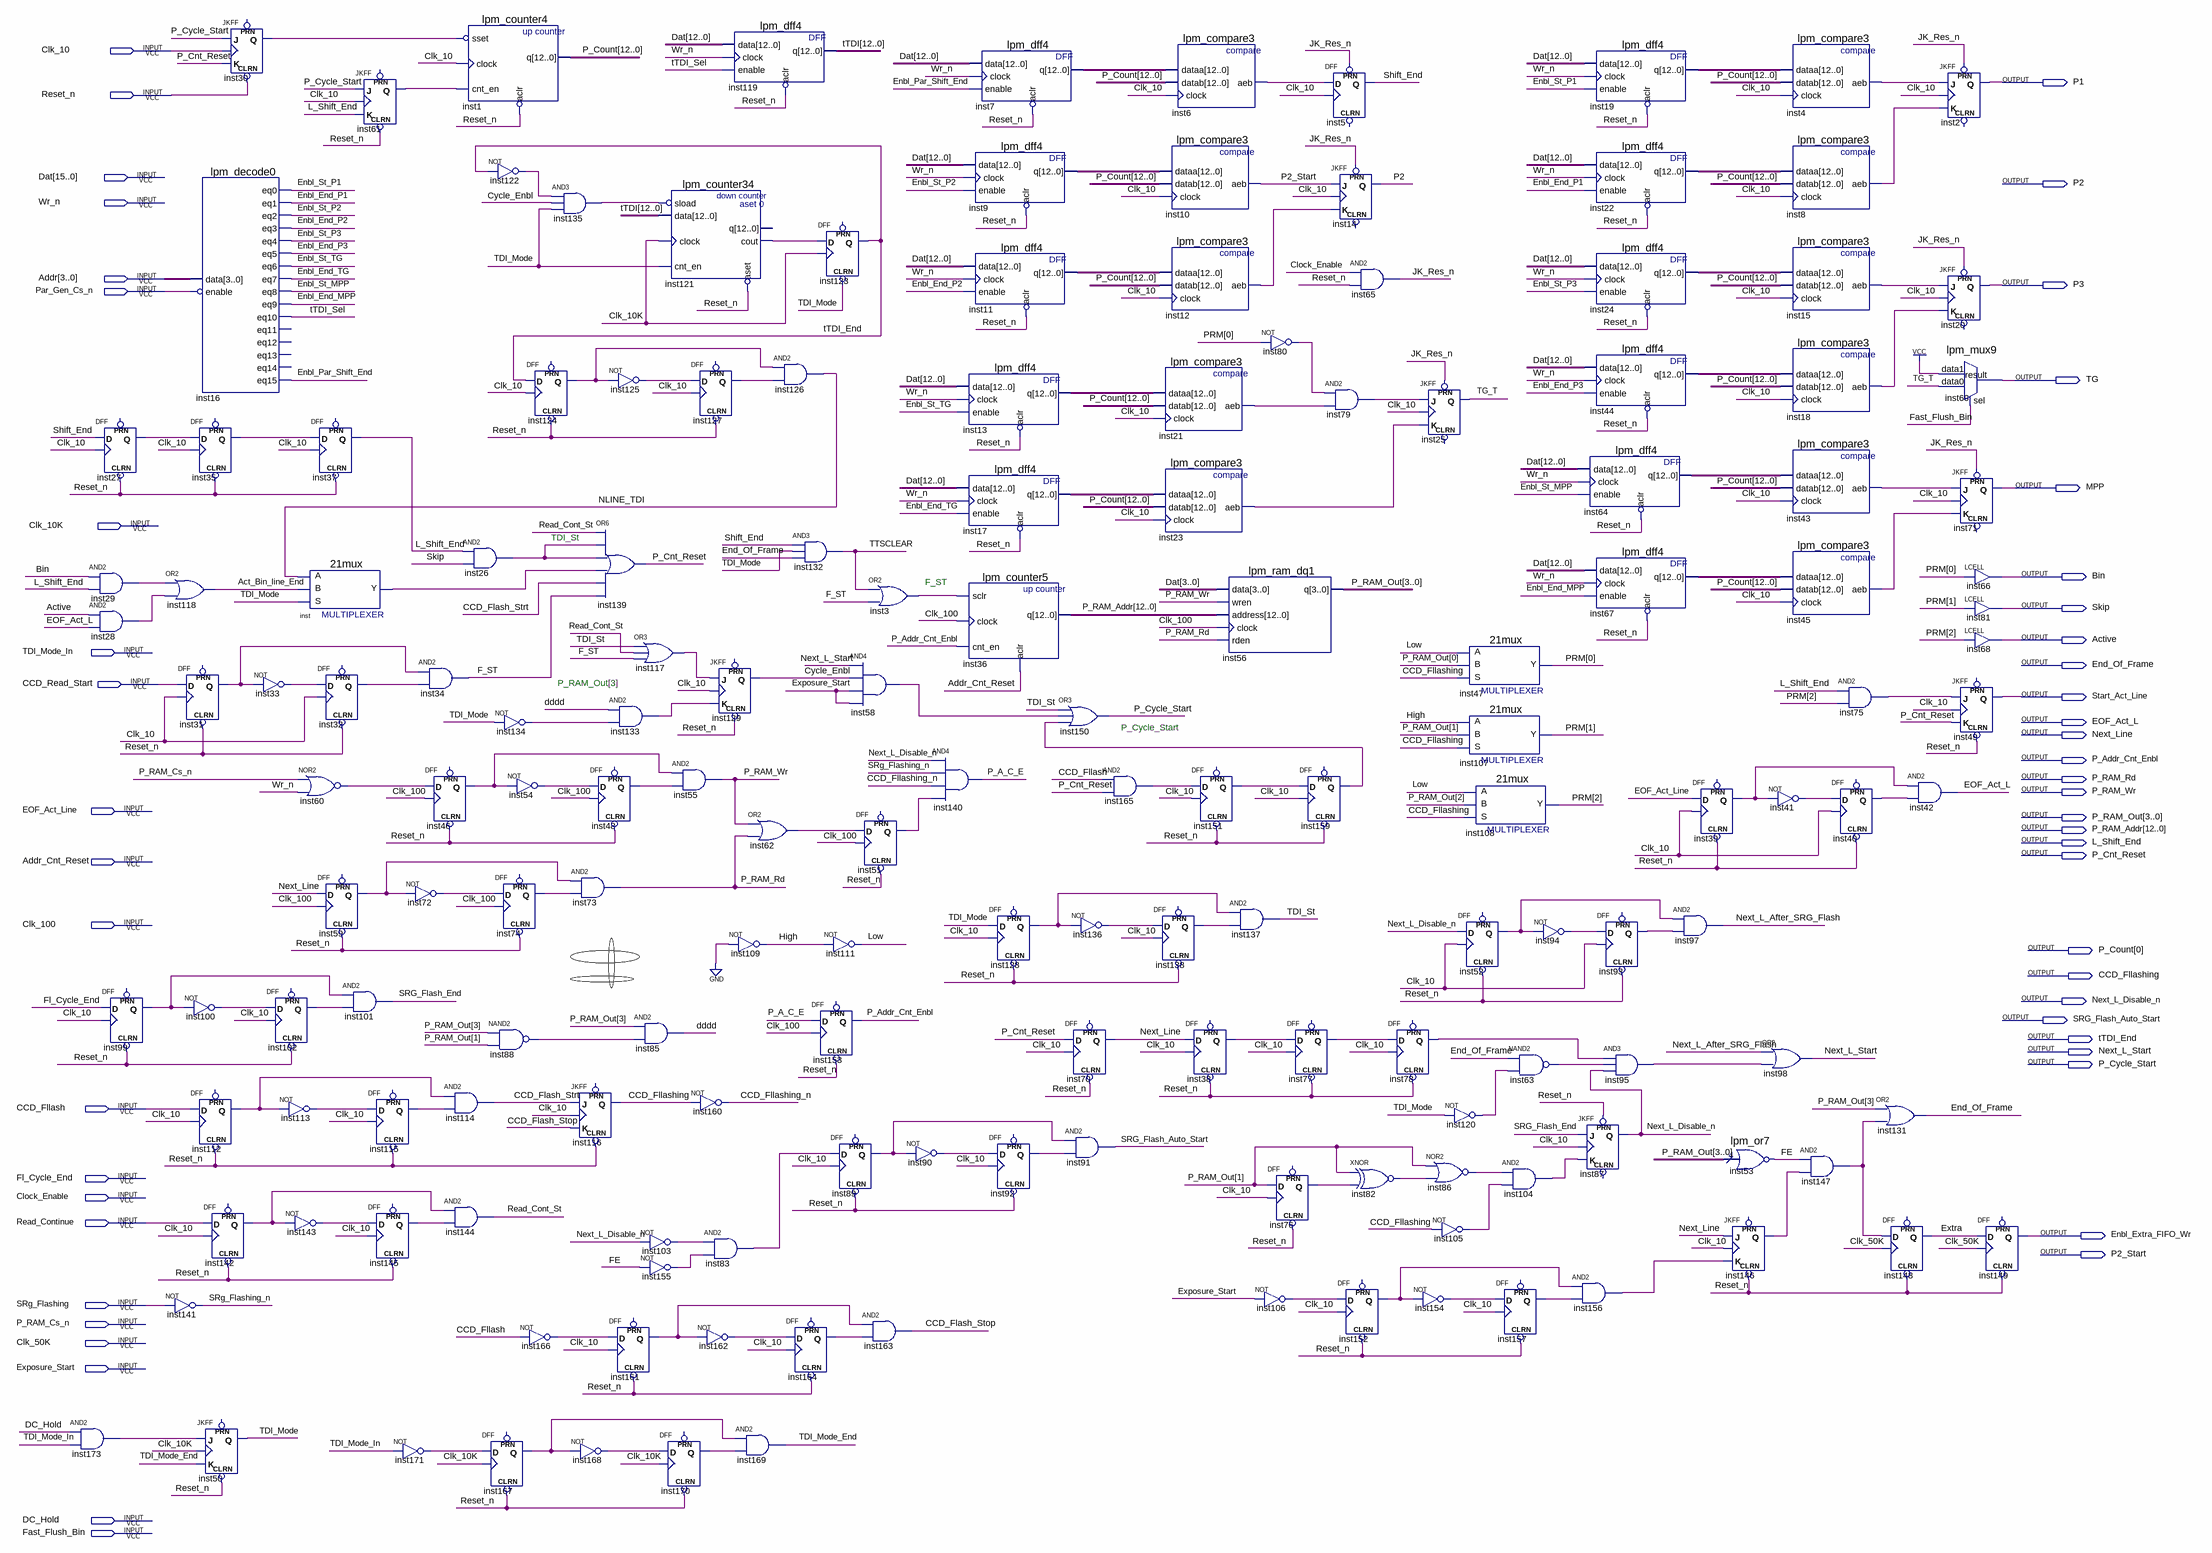
[diagram p0: schematic sheet]
// Quartus schematic Parallel_Clocks_Generator.bdf as structural Verilog: 167 symbols, 50 pins
module Parallel_Clocks_Generator (
  input  Clk_10,
  input  Reset_n,
  input  [15:0] Dat,
  input  Wr_n,
  input  [3:0] Addr,
  input  Par_Gen_Cs_n,
  input  Clk_10K,
  input  TDI_Mode_In,
  input  CCD_Read_Start,
  input  EOF_Act_Line,
  input  Addr_Cnt_Reset,
  input  Clk_100,
  input  CCD_Fllash,
  input  Fl_Cycle_End,
  input  Clock_Enable,
  input  Read_Continue,
  input  SRg_Flashing,
  input  P_RAM_Cs_n,
  input  Clk_50K,
  input  Exposure_Start,
  input  DC_Hold,
  input  Fast_Flush_Bin,
  output P1,
  output P2,
  output P3,
  output TG,
  output MPP,
  output Bin,
  output Skip,
  output Active,
  output End_Of_Frame,
  output Start_Act_Line,
  output EOF_Act_L,
  output Next_Line,
  output P_Addr_Cnt_Enbl,
  output P_RAM_Rd,
  output P_RAM_Wr,
  output [3:0] P_RAM_Out,
  output [12:0] P_RAM_Addr,
  output L_Shift_End,
  output P_Cnt_Reset,
  output [12:0] P_Count,
  output CCD_Fllashing,
  output Next_L_Disable_n,
  output SRG_Flash_Auto_Start,
  output tTDI_End,
  output Next_L_Start,
  output P_Cycle_Start,
  output Enbl_Extra_FIFO_Wr,
  output P2_Start
);

  wire Act_Bin_line_End, CCD_Flash_Stop, CCD_Flash_Strt, CCD_Fllashing_n, Cycle_Enbl, dddd, Enbl_End_MPP,
       Enbl_End_P1, Enbl_End_P2, Enbl_End_P3, Enbl_End_TG, Enbl_Par_Shift_End, Enbl_St_MPP, Enbl_St_P1,
       Enbl_St_P2, Enbl_St_P3, Enbl_St_TG, Extra, F_ST, FE, High, inst3_out, inst4_aeb, inst6_aeb, inst8_aeb,
       inst12_aeb, inst15_aeb, inst18_aeb, inst21_aeb, inst23_aeb, inst26_out, inst27_q, inst28_out,
       inst29_out, inst30_q, inst31_q, inst32_q, inst33_out, inst35_q, inst38_q, inst39_q, inst40_q,
       inst41_out, inst43_aeb, inst45_aeb, inst46_q, inst48_q, inst51_q, inst52_q, inst53_result, inst54_out,
       inst58_out, inst59_q, inst60_out, inst61_q, inst62_out, inst63_out, inst72_out, inst74_q, inst75_out,
       inst76_q, inst77_q, inst78_q, inst79_out, inst80_out, inst82_out, inst83_out, inst86_out, inst88_out,
       inst89_q, inst90_out, inst92_q, inst93_q, inst94_out, inst95_out, inst99_q, inst100_out, inst102_q,
       inst103_out, inst104_out, inst105_out, inst106_out, inst112_q, inst113_out, inst115_q, inst117_out,
       inst120_out, inst121_cout, inst122_out, inst124_q, inst125_out, inst127_q, inst128_q, inst133_out,
       inst134_out, inst135_out, inst136_out, inst138_q, inst142_q, inst143_out, inst145_q, inst146_q,
       inst147_out, inst151_q, inst152_q, inst154_out, inst155_out, inst156_out, inst157_q, inst159_q,
       inst161_q, inst162_out, inst164_q, inst165_out, inst166_out, inst167_q, inst168_out, inst170_q,
       inst171_out, inst173_out, inst_y, JK_Res_n, Low, Next_L_After_SRG_Flash, NLINE_TDI, P_A_C_E,
       Read_Cont_St, Shift_End, SRG_Flash_End, SRg_Flashing_n, TDI_Mode, TDI_Mode_End, TDI_St, TG_T,
       tTDI_Sel, TTSCLEAR;
  wire [2:0] PRM;
  wire [12:0] inst7_q, inst9_q, inst11_q, inst13_q, inst17_q, inst19_q, inst22_q, inst24_q, inst44_q,
       inst64_q, inst67_q, tTDI;

  and inst173 (inst173_out, DC_Hold, TDI_Mode_In);
  DFF inst27 (.CLRN(Reset_n), .CLK(Clk_10), .D(Shift_End), .Q(inst27_q));  // open: PRN
  and inst29 (inst29_out, Bin, L_Shift_End);
  and inst28 (inst28_out, Active, EOF_Act_L);
  DFF inst99 (.CLRN(Reset_n), .CLK(Clk_10), .D(Fl_Cycle_End), .Q(inst99_q));  // open: PRN
  or inst118 (Act_Bin_line_End, inst29_out, inst28_out);
  not inst141 (SRg_Flashing_n, SRg_Flashing);
  JKFF inst30 (.CLRN(Reset_n), .K(P_Cnt_Reset), .J(P_Cycle_Start), .CLK(Clk_10), .Q(inst30_q));  // open: PRN
  lpm_decode0 inst16 (
    .data(Addr), .enable(~Par_Gen_Cs_n), .eq0(Enbl_St_P1), .eq1(Enbl_End_P1), .eq2(Enbl_St_P2),
    .eq3(Enbl_End_P2), .eq4(Enbl_St_P3), .eq5(Enbl_End_P3), .eq6(Enbl_St_TG), .eq7(Enbl_End_TG),
    .eq8(Enbl_St_MPP), .eq9(Enbl_End_MPP), .eq10(tTDI_Sel), .eq15(Enbl_Par_Shift_End));  // open: eq11, eq12, eq13, eq14
  DFF inst35 (.CLRN(Reset_n), .CLK(Clk_10), .D(inst27_q), .Q(inst35_q));  // open: PRN
  DFF inst31 (.CLRN(Reset_n), .CLK(Clk_10), .D(CCD_Read_Start), .Q(inst31_q));  // open: PRN
  not inst100 (inst100_out, inst99_q);
  DFF inst112 (.CLRN(Reset_n), .CLK(Clk_10), .D(CCD_Fllash), .Q(inst112_q));  // open: PRN
  DFF inst142 (.CLRN(Reset_n), .CLK(Clk_10), .D(Read_Continue), .Q(inst142_q));  // open: PRN
  JKFF inst50 (.CLRN(Reset_n), .K(TDI_Mode_End), .J(inst173_out), .CLK(Clk_10K), .Q(TDI_Mode));  // open: PRN
  not inst33 (inst33_out, inst31_q);
  DFF inst102 (.CLRN(Reset_n), .CLK(Clk_10), .D(inst100_out), .Q(inst102_q));  // open: PRN
  DFF inst37 (.CLRN(Reset_n), .CLK(Clk_10), .D(inst35_q), .Q(L_Shift_End));  // open: PRN
  \21mux  inst (.S(TDI_Mode), .B(Act_Bin_line_End), .A(NLINE_TDI), .Y(inst_y));
  DFF inst32 (.CLRN(Reset_n), .CLK(Clk_10), .D(inst33_out), .Q(inst32_q));  // open: PRN
  nor inst60 (inst60_out, P_RAM_Cs_n, Wr_n);
  DFF inst59 (.CLRN(Reset_n), .CLK(Clk_100), .D(Next_Line), .Q(inst59_q));  // open: PRN
  not inst113 (inst113_out, inst112_q);
  not inst143 (inst143_out, inst142_q);
  JKFF inst61 (.CLRN(Reset_n), .K(L_Shift_End), .J(P_Cycle_Start), .CLK(Clk_10), .Q(inst61_q));  // open: PRN
  and inst101 (SRG_Flash_End, inst99_q, inst102_q);
  DFF inst115 (.CLRN(Reset_n), .CLK(Clk_10), .D(inst113_out), .Q(inst115_q));  // open: PRN
  DFF inst145 (.CLRN(Reset_n), .CLK(Clk_10), .D(inst143_out), .Q(inst145_q));  // open: PRN
  and inst34 (F_ST, inst31_q, inst32_q);
  DFF inst46 (.CLRN(Reset_n), .CLK(Clk_100), .D(inst60_out), .Q(inst46_q));  // open: PRN
  not inst72 (inst72_out, inst59_q);
  not inst171 (inst171_out, TDI_Mode_In);
  lpm_counter4 inst1 (.sset(~inst30_q), .clock(Clk_10), .cnt_en(inst61_q), .aclr(~Reset_n), .q(P_Count));
  and inst26 (inst26_out, L_Shift_End, Skip);
  and inst114 (CCD_Flash_Strt, inst112_q, inst115_q);
  and inst144 (Read_Cont_St, inst142_q, inst145_q);
  not inst122 (inst122_out, tTDI_End);
  DFF inst124 (.CLRN(Reset_n), .CLK(Clk_10), .D(tTDI_End), .Q(inst124_q));  // open: PRN
  not inst134 (inst134_out, TDI_Mode);
  not inst54 (inst54_out, inst46_q);
  DFF inst74 (.CLRN(Reset_n), .CLK(Clk_100), .D(inst72_out), .Q(inst74_q));  // open: PRN
  nand inst88 (inst88_out, P_RAM_Out[3], P_RAM_Out[1]);
  not inst166 (inst166_out, CCD_Fllash);
  DFF inst167 (.CLRN(Reset_n), .CLK(Clk_10K), .D(inst171_out), .Q(inst167_q));  // open: PRN
  and inst135 (inst135_out, inst122_out, Cycle_Enbl, TDI_Mode);
  and inst73 (P_RAM_Rd, inst59_q, inst74_q);
  JKFF inst116 (.CLRN(Reset_n), .K(CCD_Flash_Stop), .J(CCD_Flash_Strt), .CLK(Clk_10), .Q(CCD_Fllashing));  // open: PRN
  not inst168 (inst168_out, inst167_q);
  not inst125 (inst125_out, inst124_q);
  or inst139 (P_Cnt_Reset, Read_Cont_St, inst26_out, inst26_out, inst_y, CCD_Flash_Strt, F_ST);
  and inst133 (inst133_out, dddd, inst134_out);
  DFF inst48 (.CLRN(Reset_n), .CLK(Clk_100), .D(inst54_out), .Q(inst48_q));  // open: PRN
  DFF inst161 (.CLRN(Reset_n), .CLK(Clk_10), .D(inst166_out), .Q(inst161_q));  // open: PRN
  lpm_counter34 inst121 (
    .sload(~inst135_out), .data(tTDI), .clock(Clk_10K), .cnt_en(TDI_Mode), .aset(~Reset_n),
    .cout(inst121_cout));  // open: q
  or inst117 (inst117_out, TDI_St, Read_Cont_St, F_ST);
  and inst55 (P_RAM_Wr, inst46_q, inst48_q);
  and inst85 (dddd, P_RAM_Out[3], inst88_out);
  not inst103 (inst103_out, Next_L_Disable_n);
  not inst155 (inst155_out, FE);
  DFF inst170 (.CLRN(Reset_n), .CLK(Clk_10K), .D(inst168_out), .Q(inst170_q));  // open: PRN
  lpm_dff4 inst119 (.data(Dat[12:0]), .clock(Wr_n), .enable(tTDI_Sel), .aclr(~Reset_n), .q(tTDI));
  DFF inst127 (.CLRN(Reset_n), .CLK(Clk_10), .D(inst125_out), .Q(inst127_q));  // open: PRN
  JKFF inst129 (.CLRN(Reset_n), .K(inst133_out), .J(inst117_out), .CLK(Clk_10), .Q(Cycle_Enbl));  // open: PRN
  not inst109 (High, 1'b0);
  not inst160 (CCD_Fllashing_n, CCD_Fllashing);
  and inst83 (inst83_out, inst103_out, inst155_out);
  not inst162 (inst162_out, inst161_q);
  and inst126 (NLINE_TDI, inst124_q, inst127_q);
  or inst62 (inst62_out, P_RAM_Wr, P_RAM_Rd);
  and inst169 (TDI_Mode_End, inst167_q, inst170_q);
  DFF inst123 (.CLRN(TDI_Mode), .CLK(Clk_10K), .D(inst121_cout), .Q(tTDI_End));  // open: PRN
  and inst132 (TTSCLEAR, Shift_End, TDI_Mode, End_Of_Frame);
  not inst111 (Low, High);
  DFF inst153 (.CLRN(Reset_n), .CLK(Clk_100), .D(P_A_C_E), .Q(P_Addr_Cnt_Enbl));  // open: PRN
  DFF inst89 (.CLRN(Reset_n), .CLK(Clk_10), .D(inst83_out), .Q(inst89_q));  // open: PRN
  DFF inst164 (.CLRN(Reset_n), .CLK(Clk_10), .D(inst162_out), .Q(inst164_q));  // open: PRN
  or inst3 (inst3_out, TTSCLEAR, F_ST);
  and inst58 (inst58_out, Next_L_Start, Cycle_Enbl, Exposure_Start, Exposure_Start);
  DFF inst51 (.CLRN(Reset_n), .CLK(Clk_100), .D(inst62_out), .Q(inst51_q));  // open: PRN
  and inst163 (CCD_Flash_Stop, inst161_q, inst164_q);
  and inst140 (P_A_C_E, Next_L_Disable_n, SRg_Flashing_n, CCD_Fllashing_n, inst51_q);
  not inst90 (inst90_out, inst89_q);
  lpm_dff4 inst7 (.data(Dat[12:0]), .clock(Wr_n), .enable(Enbl_Par_Shift_End), .aclr(~Reset_n), .q(inst7_q));
  lpm_dff4 inst9 (.data(Dat[12:0]), .clock(Wr_n), .enable(Enbl_St_P2), .aclr(~Reset_n), .q(inst9_q));
  lpm_dff4 inst11 (.data(Dat[12:0]), .clock(Wr_n), .enable(Enbl_End_P2), .aclr(~Reset_n), .q(inst11_q));
  lpm_dff4 inst13 (.data(Dat[12:0]), .clock(Wr_n), .enable(Enbl_St_TG), .aclr(~Reset_n), .q(inst13_q));
  lpm_dff4 inst17 (.data(Dat[12:0]), .clock(Wr_n), .enable(Enbl_End_TG), .aclr(~Reset_n), .q(inst17_q));
  lpm_counter5 inst36 (
    .sclr(inst3_out), .clock(Clk_100), .cnt_en(P_Addr_Cnt_Enbl), .aclr(Addr_Cnt_Reset), .q(P_RAM_Addr));
  DFF inst128 (.CLRN(Reset_n), .CLK(Clk_10), .D(TDI_Mode), .Q(inst128_q));  // open: PRN
  DFF inst92 (.CLRN(Reset_n), .CLK(Clk_10), .D(inst90_out), .Q(inst92_q));  // open: PRN
  or inst150 (P_Cycle_Start, TDI_St, inst58_out, inst159_q);
  not inst136 (inst136_out, inst128_q);
  DFF inst70 (.CLRN(Reset_n), .CLK(Clk_10), .D(P_Cnt_Reset), .Q(Next_Line));  // open: PRN
  and inst91 (SRG_Flash_Auto_Start, inst89_q, inst92_q);
  and inst165 (inst165_out, CCD_Fllash, P_Cnt_Reset);
  lpm_compare3 inst6 (.dataa(inst7_q), .datab(P_Count), .clock(Clk_10), .aeb(inst6_aeb));
  lpm_compare3 inst10 (.dataa(inst9_q), .datab(P_Count), .clock(Clk_10), .aeb(P2_Start));
  lpm_compare3 inst12 (.dataa(inst11_q), .datab(P_Count), .clock(Clk_10), .aeb(inst12_aeb));
  lpm_compare3 inst21 (.dataa(inst13_q), .datab(P_Count), .clock(Clk_10), .aeb(inst21_aeb));
  lpm_compare3 inst23 (.dataa(inst17_q), .datab(P_Count), .clock(Clk_10), .aeb(inst23_aeb));
  DFF inst138 (.CLRN(Reset_n), .CLK(Clk_10), .D(inst136_out), .Q(inst138_q));  // open: PRN
  DFF inst38 (.CLRN(Reset_n), .CLK(Clk_10), .D(Next_Line), .Q(inst38_q));  // open: PRN
  lpm_ram_dq1 inst56 (
    .data(Dat[3:0]), .wren(P_RAM_Wr), .address(P_RAM_Addr), .clock(Clk_100), .rden(P_RAM_Rd), .q(P_RAM_Out));
  DFF inst151 (.CLRN(Reset_n), .CLK(Clk_10), .D(inst165_out), .Q(inst151_q));  // open: PRN
  and inst137 (TDI_St, inst128_q, inst138_q);
  not inst80 (inst80_out, PRM[0]);
  DFF inst77 (.CLRN(Reset_n), .CLK(Clk_10), .D(inst38_q), .Q(inst77_q));  // open: PRN
  DFF inst76 (.CLRN(Reset_n), .CLK(Clk_10), .D(P_RAM_Out[1]), .Q(inst76_q));  // open: PRN
  not inst106 (inst106_out, Exposure_Start);
  DFF inst5 (.CLK(Clk_10), .D(inst6_aeb), .PRN(JK_Res_n), .Q(Shift_End));  // open: CLRN
  JKFF inst14 (.PRN(JK_Res_n), .K(inst12_aeb), .J(P2_Start), .CLK(Clk_10), .Q(P2));  // open: CLRN
  and inst79 (inst79_out, inst80_out, inst21_aeb);
  DFF inst159 (.CLRN(Reset_n), .CLK(Clk_10), .D(inst151_q), .Q(inst159_q));  // open: PRN
  DFF inst152 (.CLRN(Reset_n), .CLK(Clk_10), .D(inst106_out), .Q(inst152_q));  // open: PRN
  and inst65 (JK_Res_n, Clock_Enable, Reset_n);
  DFF inst78 (.CLRN(Reset_n), .CLK(Clk_10), .D(inst77_q), .Q(inst78_q));  // open: PRN
  xnor inst82 (inst82_out, P_RAM_Out[1], inst76_q);
  JKFF inst25 (.PRN(JK_Res_n), .K(inst23_aeb), .J(inst79_out), .CLK(Clk_10), .Q(TG_T));  // open: CLRN
  nor inst86 (inst86_out, P_RAM_Out[1], inst82_out);
  not inst105 (inst105_out, CCD_Fllashing);
  not inst154 (inst154_out, inst152_q);
  \21mux  inst47 (.S(CCD_Fllashing), .B(P_RAM_Out[0]), .A(Low), .Y(PRM[0]));
  \21mux  inst107 (.S(CCD_Fllashing), .B(P_RAM_Out[1]), .A(High), .Y(PRM[1]));
  \21mux  inst108 (.S(CCD_Fllashing), .B(P_RAM_Out[2]), .A(Low), .Y(PRM[2]));
  DFF inst52 (.CLRN(Reset_n), .CLK(Clk_10), .D(Next_L_Disable_n), .Q(inst52_q));  // open: PRN
  not inst120 (inst120_out, TDI_Mode);
  not inst94 (inst94_out, inst52_q);
  nand inst63 (inst63_out, End_Of_Frame, inst120_out);
  and inst104 (inst104_out, inst86_out, inst105_out);
  DFF inst157 (.CLRN(Reset_n), .CLK(Clk_10), .D(inst154_out), .Q(inst157_q));  // open: PRN
  lpm_dff4 inst19 (.data(Dat[12:0]), .clock(Wr_n), .enable(Enbl_St_P1), .aclr(~Reset_n), .q(inst19_q));
  lpm_dff4 inst22 (.data(Dat[12:0]), .clock(Wr_n), .enable(Enbl_End_P1), .aclr(~Reset_n), .q(inst22_q));
  lpm_dff4 inst24 (.data(Dat[12:0]), .clock(Wr_n), .enable(Enbl_St_P3), .aclr(~Reset_n), .q(inst24_q));
  lpm_dff4 inst44 (.data(Dat[12:0]), .clock(Wr_n), .enable(Enbl_End_P3), .aclr(~Reset_n), .q(inst44_q));
  lpm_dff4 inst64 (.data(Dat[12:0]), .clock(Wr_n), .enable(Enbl_St_MPP), .aclr(~Reset_n), .q(inst64_q));
  lpm_dff4 inst67 (.data(Dat[12:0]), .clock(Wr_n), .enable(Enbl_End_MPP), .aclr(~Reset_n), .q(inst67_q));
  JKFF inst87 (.PRN(Reset_n), .K(inst104_out), .J(SRG_Flash_End), .CLK(Clk_10), .Q(Next_L_Disable_n));  // open: CLRN
  and inst156 (inst156_out, inst152_q, inst157_q);
  DFF inst93 (.CLRN(Reset_n), .CLK(Clk_10), .D(inst94_out), .Q(inst93_q));  // open: PRN
  and inst95 (inst95_out, inst78_q, inst63_out, Next_L_Disable_n);
  DFF inst39 (.CLRN(Reset_n), .CLK(Clk_10), .D(EOF_Act_Line), .Q(inst39_q));  // open: PRN
  and inst97 (Next_L_After_SRG_Flash, inst52_q, inst93_q);
  lpm_or7 inst53 (.data(P_RAM_Out), .result(inst53_result));
  not inst53_result_inverted (FE, inst53_result);
  JKFF inst146 (.CLRN(Reset_n), .K(inst156_out), .J(Next_Line), .CLK(Clk_10), .Q(inst146_q));  // open: PRN
  lpm_compare3 inst4 (.dataa(inst19_q), .datab(P_Count), .clock(Clk_10), .aeb(inst4_aeb));
  lpm_compare3 inst8 (.dataa(inst22_q), .datab(P_Count), .clock(Clk_10), .aeb(inst8_aeb));
  lpm_compare3 inst15 (.dataa(inst24_q), .datab(P_Count), .clock(Clk_10), .aeb(inst15_aeb));
  lpm_compare3 inst18 (.dataa(inst44_q), .datab(P_Count), .clock(Clk_10), .aeb(inst18_aeb));
  lpm_compare3 inst43 (.dataa(inst64_q), .datab(P_Count), .clock(Clk_10), .aeb(inst43_aeb));
  lpm_compare3 inst45 (.dataa(inst67_q), .datab(P_Count), .clock(Clk_10), .aeb(inst45_aeb));
  not inst41 (inst41_out, inst39_q);
  or inst98 (Next_L_Start, Next_L_After_SRG_Flash, inst95_out);
  and inst75 (inst75_out, L_Shift_End, PRM[2]);
  DFF inst40 (.CLRN(Reset_n), .CLK(Clk_10), .D(inst41_out), .Q(inst40_q));  // open: PRN
  and inst147 (inst147_out, FE, inst146_q);
  or inst131 (End_Of_Frame, P_RAM_Out[3], inst147_out);
  DFF inst148 (.CLRN(Reset_n), .CLK(Clk_50K), .D(inst147_out), .Q(Extra));  // open: PRN
  JKFF inst2 (.PRN(JK_Res_n), .K(inst8_aeb), .J(inst4_aeb), .CLK(Clk_10), .Q(P1));  // open: CLRN
  JKFF inst20 (.PRN(JK_Res_n), .K(inst18_aeb), .J(inst15_aeb), .CLK(Clk_10), .Q(P3));  // open: CLRN
  lpm_mux9 inst69 (.data1(1'b1), .data0(TG_T), .sel(Fast_Flush_Bin), .result(TG));
  and inst42 (EOF_Act_L, inst39_q, inst40_q);
  JKFF inst71 (.PRN(JK_Res_n), .K(inst45_aeb), .J(inst43_aeb), .CLK(Clk_10), .Q(MPP));  // open: CLRN
  LCELL inst66 (.IN(PRM[0]), .OUT(Bin));
  LCELL inst81 (.IN(PRM[1]), .OUT(Skip));
  LCELL inst68 (.IN(PRM[2]), .OUT(Active));
  JKFF inst49 (.CLRN(Reset_n), .K(P_Cnt_Reset), .J(inst75_out), .CLK(Clk_10), .Q(Start_Act_Line));  // open: PRN
  DFF inst149 (.CLRN(Reset_n), .CLK(Clk_50K), .D(Extra), .Q(Enbl_Extra_FIFO_Wr));  // open: PRN

  // Notes on the sheet:
  //   TDI_St
  //   F_ST
  //   P_RAM_Out[3]
  //   P_Cycle_Start
endmodule
